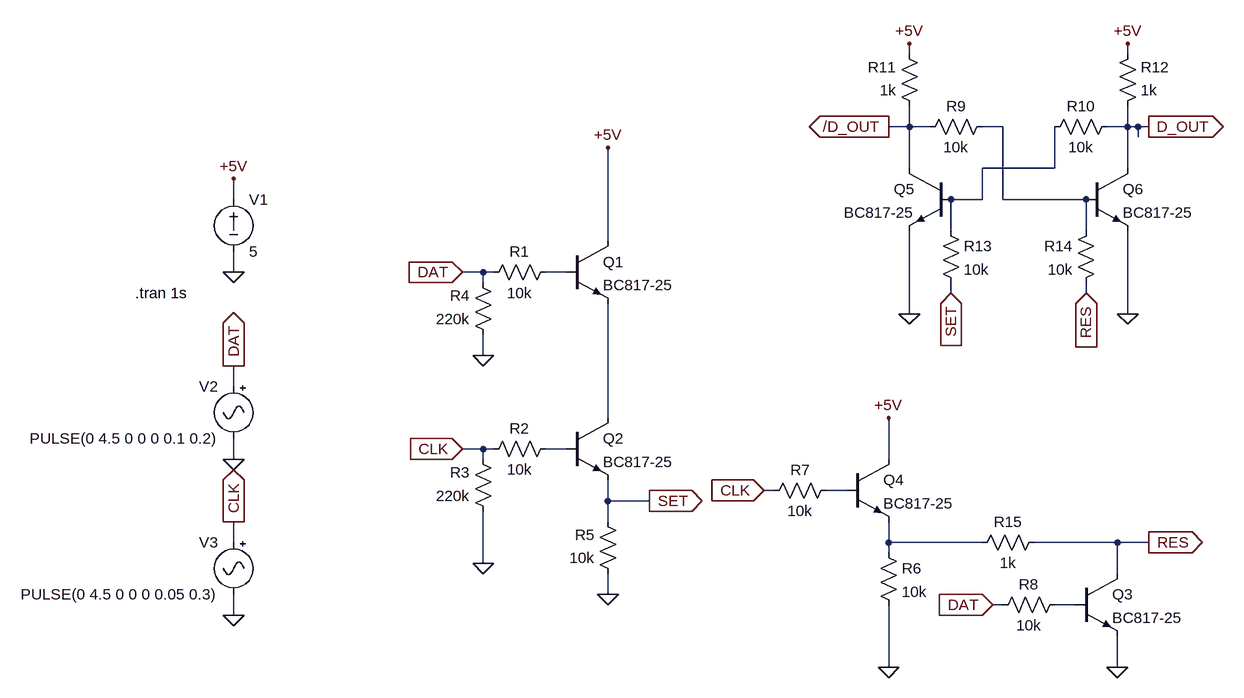
[diagram p0: schematic FlipFlop-self.asc]
FlipFlop-self.asc, the LTspice schematic file:
Version 4
SHEET 1 1532 1044
WIRE 656 -320 656 -336
WIRE 992 -320 992 -336
WIRE 656 -208 656 -240
WIRE 656 -208 624 -208
WIRE 688 -208 656 -208
WIRE 800 -208 768 -208
WIRE 992 -208 992 -240
WIRE 992 -208 960 -208
WIRE 1008 -208 992 -208
WIRE 1024 -208 1008 -208
WIRE 1008 -192 1008 -208
WIRE 656 -144 656 -208
WIRE 880 -144 880 -208
WIRE 880 -144 768 -144
WIRE 992 -144 992 -208
WIRE -384 -96 -384 -128
WIRE 768 -96 768 -144
WIRE 768 -96 720 -96
WIRE 800 -96 800 -208
WIRE 928 -96 800 -96
WIRE -384 -48 -384 -64
WIRE 720 -48 720 -96
WIRE 928 -48 928 -96
WIRE 192 -32 192 -176
WIRE -384 16 -384 -16
WIRE 0 16 -32 16
WIRE 16 16 0 16
WIRE 128 16 96 16
WIRE 0 32 0 16
WIRE 720 48 720 32
WIRE 928 48 928 32
WIRE 656 80 656 -48
WIRE 992 80 992 -48
WIRE 0 144 0 112
WIRE -384 192 -384 160
WIRE 192 240 192 64
WIRE 0 288 -32 288
WIRE 16 288 0 288
WIRE 128 288 96 288
WIRE -384 304 -384 272
WIRE 0 304 0 288
WIRE 624 304 624 240
WIRE 448 352 432 352
WIRE 560 352 528 352
WIRE 192 368 192 336
WIRE 256 368 192 368
WIRE 192 400 192 368
WIRE -384 432 -384 400
WIRE 624 432 624 400
WIRE 768 432 624 432
WIRE 976 432 848 432
WIRE 1024 432 976 432
WIRE 624 448 624 432
WIRE 0 464 0 384
WIRE 976 480 976 432
WIRE 192 512 192 480
WIRE 800 528 784 528
WIRE 912 528 880 528
WIRE -384 544 -384 512
WIRE 624 624 624 528
WIRE 976 624 976 576
FLAG 192 512 0
FLAG 0 144 0
FLAG 0 464 0
FLAG -384 16 0
FLAG -384 304 0
FLAG -384 544 0
FLAG 432 352 CLK
IOPIN 432 352 In
FLAG 656 80 0
FLAG 992 80 0
FLAG 720 48 SET
IOPIN 720 48 In
FLAG 928 48 RES
IOPIN 928 48 In
FLAG 624 -208 /D_OUT
IOPIN 624 -208 Out
FLAG 1024 -208 D_OUT
IOPIN 1024 -208 Out
FLAG -384 -128 +5V
FLAG 192 -176 +5V
FLAG 624 240 +5V
FLAG 656 -336 +5V
FLAG 992 -336 +5V
FLAG -384 160 DAT
IOPIN -384 160 Out
FLAG -384 400 CLK
IOPIN -384 400 Out
FLAG -32 16 DAT
IOPIN -32 16 In
FLAG -32 288 CLK
IOPIN -32 288 In
FLAG 256 368 SET
IOPIN 256 368 Out
FLAG 624 624 0
FLAG 976 624 0
FLAG 1024 432 RES
IOPIN 1024 432 Out
FLAG 784 528 DAT
IOPIN 784 528 In
SYMBOL npn 128 -32 R0
SYMATTR InstName Q1
SYMATTR Value BC817-25
SYMBOL npn 128 240 R0
SYMATTR InstName Q2
SYMATTR Value BC817-25
SYMBOL voltage -384 -112 R0
WINDOW 123 0 0 Left 2
WINDOW 39 0 0 Left 2
SYMATTR InstName V1
SYMATTR Value 5
SYMBOL res 112 0 R90
WINDOW 0 0 56 VBottom 2
WINDOW 3 32 56 VTop 2
SYMATTR InstName R1
SYMATTR Value 10k
SYMBOL res 112 272 R90
WINDOW 0 0 56 VBottom 2
WINDOW 3 32 56 VTop 2
SYMATTR InstName R2
SYMATTR Value 10k
SYMBOL res 16 400 R180
WINDOW 0 36 76 Left 2
WINDOW 3 36 40 Left 2
SYMATTR InstName R3
SYMATTR Value 220k
SYMBOL res 16 128 R180
WINDOW 0 36 76 Left 2
WINDOW 3 36 40 Left 2
SYMATTR InstName R4
SYMATTR Value 220k
SYMBOL res 208 496 R180
WINDOW 0 36 76 Left 2
WINDOW 3 36 40 Left 2
SYMATTR InstName R5
SYMATTR Value 10k
SYMBOL Misc\\signal -384 176 M0
WINDOW 123 0 0 Left 2
WINDOW 39 0 0 Left 2
SYMATTR InstName V2
SYMATTR Value PULSE(0 4.5 0 0 0 0.1 0.2)
SYMBOL Misc\\signal -384 416 M0
WINDOW 123 0 0 Left 2
WINDOW 39 0 0 Left 2
SYMATTR InstName V3
SYMATTR Value PULSE(0 4.5 0 0 0 0.05 0.3)
SYMBOL npn 912 480 R0
SYMATTR InstName Q3
SYMATTR Value BC817-25
SYMBOL npn 560 304 R0
SYMATTR InstName Q4
SYMATTR Value BC817-25
SYMBOL res 608 432 R0
SYMATTR InstName R6
SYMATTR Value 10k
SYMBOL res 544 336 R90
WINDOW 0 0 56 VBottom 2
WINDOW 3 32 56 VTop 2
SYMATTR InstName R7
SYMATTR Value 10k
SYMBOL res 896 512 R90
WINDOW 0 0 56 VBottom 2
WINDOW 3 32 56 VTop 2
SYMATTR InstName R8
SYMATTR Value 10k
SYMBOL npn 720 -144 M0
SYMATTR InstName Q5
SYMATTR Value BC817-25
SYMBOL npn 928 -144 R0
SYMATTR InstName Q6
SYMATTR Value BC817-25
SYMBOL res 784 -224 R90
WINDOW 0 0 56 VBottom 2
WINDOW 3 32 56 VTop 2
SYMATTR InstName R9
SYMATTR Value 10k
SYMBOL res 976 -224 R90
WINDOW 0 0 56 VBottom 2
WINDOW 3 32 56 VTop 2
SYMATTR InstName R10
SYMATTR Value 10k
SYMBOL res 672 -224 R180
WINDOW 0 36 76 Left 2
WINDOW 3 36 40 Left 2
SYMATTR InstName R11
SYMATTR Value 1k
SYMBOL res 976 -224 M180
WINDOW 0 36 76 Left 2
WINDOW 3 36 40 Left 2
SYMATTR InstName R12
SYMATTR Value 1k
SYMBOL res 704 -64 R0
SYMATTR InstName R13
SYMATTR Value 10k
SYMBOL res 944 -64 M0
SYMATTR InstName R14
SYMATTR Value 10k
SYMBOL res 864 416 R90
WINDOW 0 0 56 VBottom 2
WINDOW 3 32 56 VTop 2
SYMATTR InstName R15
SYMATTR Value 1k
TEXT -536 48 Left 2 !.tran 1s

The netlist it stands for:
* FlipFlop-self.asc
Q1 +5V N004 N005 0 BC817-25
Q2 N005 N006 SET 0 BC817-25
V1 +5V 0 5
R1 N004 DAT 10k
R2 N006 CLK 10k
R3 0 CLK 220k
R4 0 DAT 220k
R5 0 SET 10k
V2 DAT 0 PULSE(0 4.5 0 0 0 0.1 0.2)
V3 CLK 0 PULSE(0 4.5 0 0 0 0.05 0.3)
Q3 RES N009 0 0 BC817-25
Q4 +5V N007 N008 0 BC817-25
R6 N008 0 10k
R7 N007 CLK 10k
R8 N009 DAT 10k
Q5 /D_OUT N002 0 0 BC817-25
Q6 D_OUT N001 0 0 BC817-25
R9 N001 /D_OUT 10k
R10 D_OUT N002 10k
R11 /D_OUT +5V 1k
R12 D_OUT +5V 1k
R13 N002 SET 10k
R14 N001 RES 10k
R15 RES N008 1k
.model NPN NPN
.model PNP PNP
.lib standard.bjt
.tran 1s
.backanno
.end